# Altium schematic sheet sensors.SchDoc
size A4
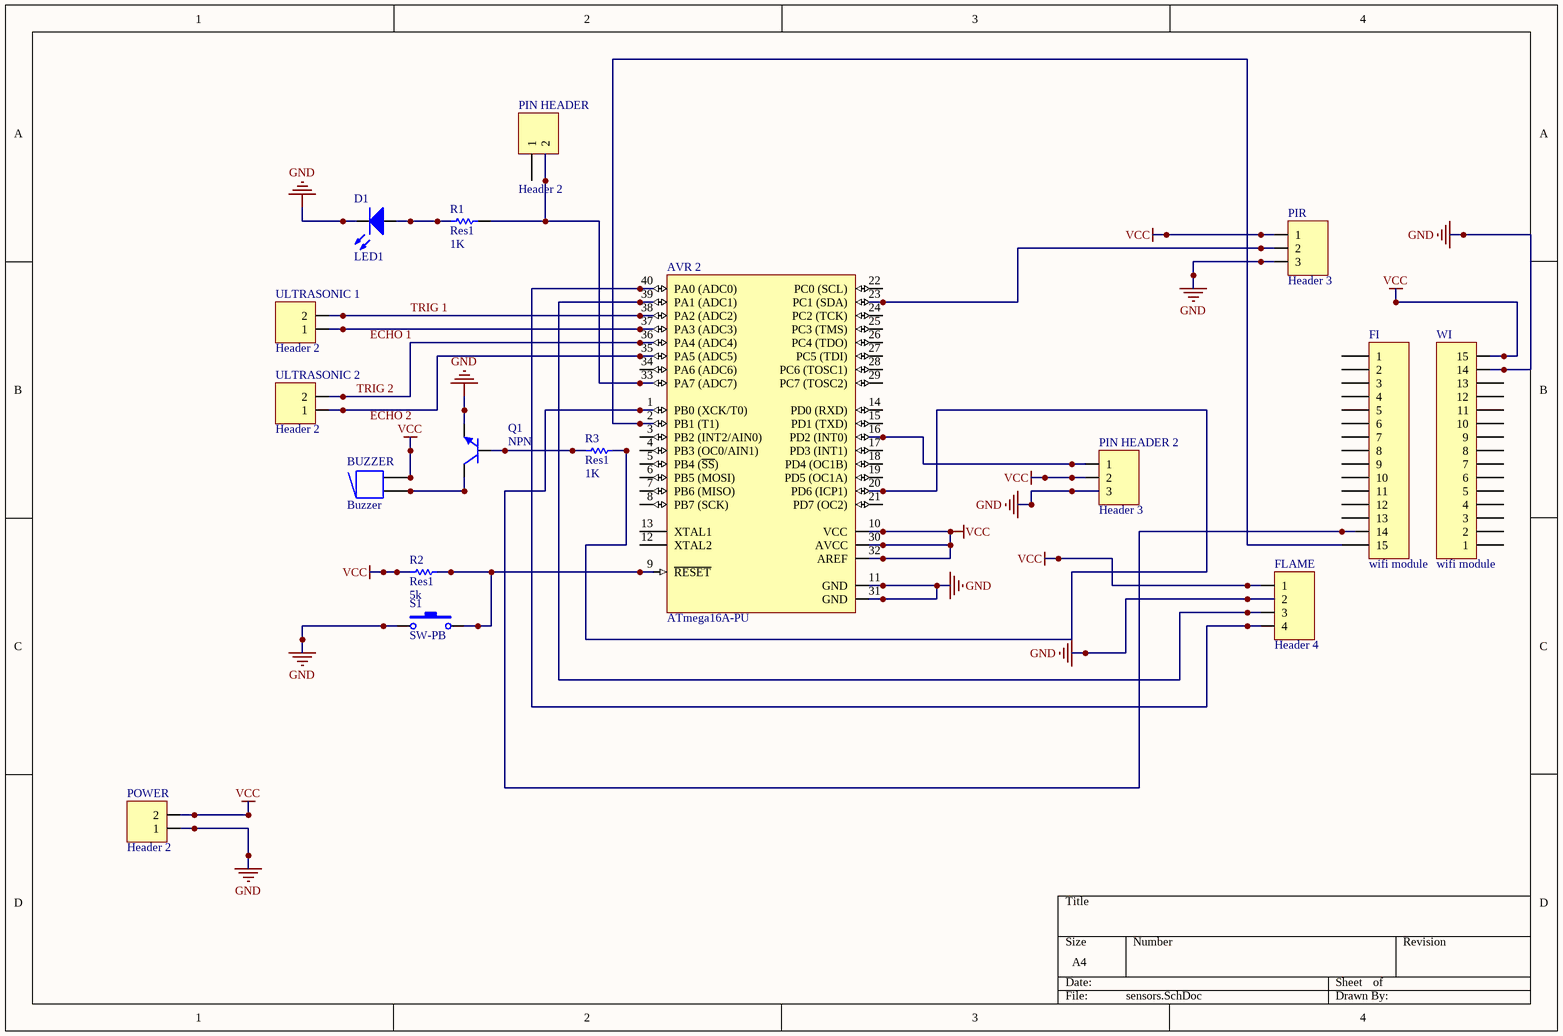
[diagram p0: sensors.SchDoc]

## Parts
AVR_2  ATmega16A-PU  [40P6]
BUZZER  Buzzer  [ABSM-1574]
D1  LED1  [LED-1]
FI  wifi module  [HDR1X15]
FLAME  Header 4  [HDR1X4]
PIN_HEADER  Header 2  [HDR1X2]
PIN_HEADER_2  Header 3  [HDR1X3]
PIR  Header 3  [HDR1X3]
POWER  Header 2  [HDR1X2]
Q1  NPN  [TO-226-AA]
R1  Res1  value 1K  [AXIAL-0.3]
R2  Res1  value 5k  [AXIAL-0.3]
R3  Res1  value 1K  [AXIAL-0.3]
S1  SW-PB  [SPST-2]
ULTRASONIC_1  Header 2  [HDR1X2]
ULTRASONIC_2  Header 2  [HDR1X2]
WI  wifi module  [HDR1X15]

## Nets
GND: AVR_2.11(GND) AVR_2.31(GND) D1.2(K) FLAME.2 PIN_HEADER_2.3 PIR.3 POWER.1 Q1.3(E) S1.1 WI.14
VCC: AVR_2.10(VCC) AVR_2.30(AVCC) AVR_2.32(AREF) BUZZER.2 BUZZER.2A FLAME.1 PIN_HEADER_2.2 PIR.1 POWER.2 R2.2 WI.15
TRIG 1: AVR_2.38(PA2_(ADC2)) ULTRASONIC_1.2
TRIG 2: AVR_2.36(PA4_(ADC4)) ULTRASONIC_2.2
NetAVR_2_1: AVR_2.1(PB0_(XCK/T0)) FI.14
NetAVR_2_2: AVR_2.2(PB1_(T1)) FI.15
NetAVR_2_9: AVR_2.9(~{RESET}) R2.1 S1.2
NetAVR_2_16: AVR_2.16(PD2_(INT0)) PIN_HEADER_2.1
NetAVR_2_20: AVR_2.20(PD6_(ICP1)) R3.2
NetAVR_2_23: AVR_2.23(PC1_(SDA)) PIR.2
NetAVR_2_33: AVR_2.33(PA7_(ADC7)) PIN_HEADER.2 R1.1
NetAVR_2_35: AVR_2.35(PA5_(ADC5)) ULTRASONIC_2.1
NetAVR_2_37: AVR_2.37(PA3_(ADC3)) ULTRASONIC_1.1
NetAVR_2_39: AVR_2.39(PA1_(ADC1)) FLAME.3
NetAVR_2_40: AVR_2.40(PA0_(ADC0)) FLAME.4
NetBUZZER_1: BUZZER.1 BUZZER.1A Q1.1(C)
NetD1_1: D1.1(A) R1.2
NetQ1_2: Q1.2(B) R3.1

Not connected (* = marked no-connect by the designer): AVR_2 3(PB2_(INT2/AIN0)) 4(PB3_(OC0/AIN1)) 5(PB4_(~{SS})) 6(PB5_(MOSI)) 7(PB6_(MISO)) 8(PB7_(SCK)) 12(XTAL2) 13(XTAL1) 14(PD0_(RXD)) 15(PD1_(TXD)) 17(PD3_(INT1)) 18(PD4_(OC1B)) 19(PD5_(OC1A)) 21(PD7_(OC2)) 22(PC0_(SCL)) 24(PC2_(TCK)) 25(PC3_(TMS)) 26(PC4_(TDO)) 27(PC5_(TDI)) 28(PC6_(TOSC1)) 29(PC7_(TOSC2)) 34(PA6_(ADC6)); FI 1 2 3 4 5 6 7 8 9 10 11 12 13; PIN_HEADER 1; WI 1 2 3 4 5 6 7 8 9 10 11 12 13

## Notes on the sheet
- Labels drawn without touching a wire or pin: ECHO 1, ECHO 2

## Library data of the parts
AVR_2 = ATmega16A-PU: 8-bit AVR Microcontroller, 16KB Flash, 512 Bytes EEPROM, 1KB SRAM, 40-pin PDIP, Industrial Grade (-40°C to 85°C); Published: 1-Apr-2010; DatasheetVersion: revB, Jul-2009; PackageVersion: revB, Sep-2001; PackageReference: 40P6; Publisher: Altium Limited; PackageDescription: 40-lead (0.600"/15.24mm Wide) Plastic Dual Inline Package (PDIP); Supplier 1: Digi-Key; Supplier Part Number 1: ATMEGA16A-PU-ND; Supplier 2: Farnell; Supplier Part Number 2: 1704561; Supplier 3: Mouser; Supplier Part Number 3: 556-ATMEGA16A-PU; Code_JEDEC: MS-011-AC; ComponentLink1Description: Manufacturer Link; ComponentLink1URL: http://www.atmel.com/products/avr/default.asp?; ComponentLink2Description: ATmega16A Datasheet; ComponentLink2URL: http://www.atmel.com/dyn/resources/prod_documents/doc8154.pdf; ComponentLink3Description: ATmega16A Summary; ComponentLink3URL: http://www.atmel.com/dyn/resources/prod_documents/8154S.pdf; ComponentLink4Description: Atmel.com Home; ComponentLink4URL: http://www.atmel.com
BUZZER = Buzzer: Magnetic Transducer Buzzer; Published: 24-Mar-1999; LatestRevisionDate: 17-Dec-2003; LatestRevisionNote: Schematic revised, PCB Footprint replaced.; DatasheetVersion: 17-Dec-2003; PackageReference: ABSM-1574; Publisher: Altium Limited; PackageDescription: Magnetic Transducer Buzzer; ComponentLink1Description: Manufacturer Link; ComponentLink1URL: http://www.megastar.com/linecard/buzzmode/index.php
D1 = LED1: Typical RED GaAs LED; Published: 8-Jun-2000; LatestRevisionDate: 08-Jul-2005; LatestRevisionNote: Mech Layer 1 removed.; PackageReference: LED-1; Publisher: Altium Limited; PackageDescription: LED; 2 Leads
FI WI = Header 15: Header, 15-Pin; LatestRevisionDate: 17-Jul-2002; LatestRevisionNote: Re-released for DXP Platform.; Publisher: Altium Limited
FLAME = Header 4: Header, 4-Pin; LatestRevisionDate: 17-Jul-2002; LatestRevisionNote: Re-released for DXP Platform.; Publisher: Altium Limited
PIN_HEADER POWER ULTRASONIC_1 ULTRASONIC_2 = Header 2: Header, 2-Pin; LatestRevisionDate: 17-Jul-2002; LatestRevisionNote: Re-released for DXP Platform.; Publisher: Altium Limited
PIN_HEADER_2 PIR = Header 3: Header, 3-Pin; LatestRevisionDate: 17-Jul-2002; LatestRevisionNote: Re-released for DXP Platform.; Publisher: Altium Limited
Q1 = NPN: NPN Bipolar Transistor; Published: 8-Jun-2000; LatestRevisionDate: 17-Jul-2002; LatestRevisionNote: Re-released for DXP Platform.; PackageReference: TO-226-AA; Publisher: Altium Limited; PackageDescription: TO, Flat Index; 3 In-Line, Axial Leads; Body Dia. 4.8mm; Leads 0.55 x 0.51 mm (max); Code_JEDEC: TO-226-AA
R1-R3 = Res1: Resistor; Published: 8-Jun-2000; LatestRevisionDate: 17-Jul-2002; LatestRevisionNote: Re-released for DXP Platform.; PackageReference: AXIAL-0.3; Publisher: Altium Limited; PackageDescription: Axial Device, Thru-Hole; 2 Leads; 0.3 in Pin Spacing
S1 = SW-PB: Switch; Published: 24-Mar-1999; LatestRevisionDate: 17-Jul-2002; LatestRevisionNote: Re-released for DXP Platform.; PackageReference: SPST-2; Publisher: Altium Limited; PackageDescription: Switch; 2 Leads